# EAGLE design Shield (EAGLE 8.7.0)
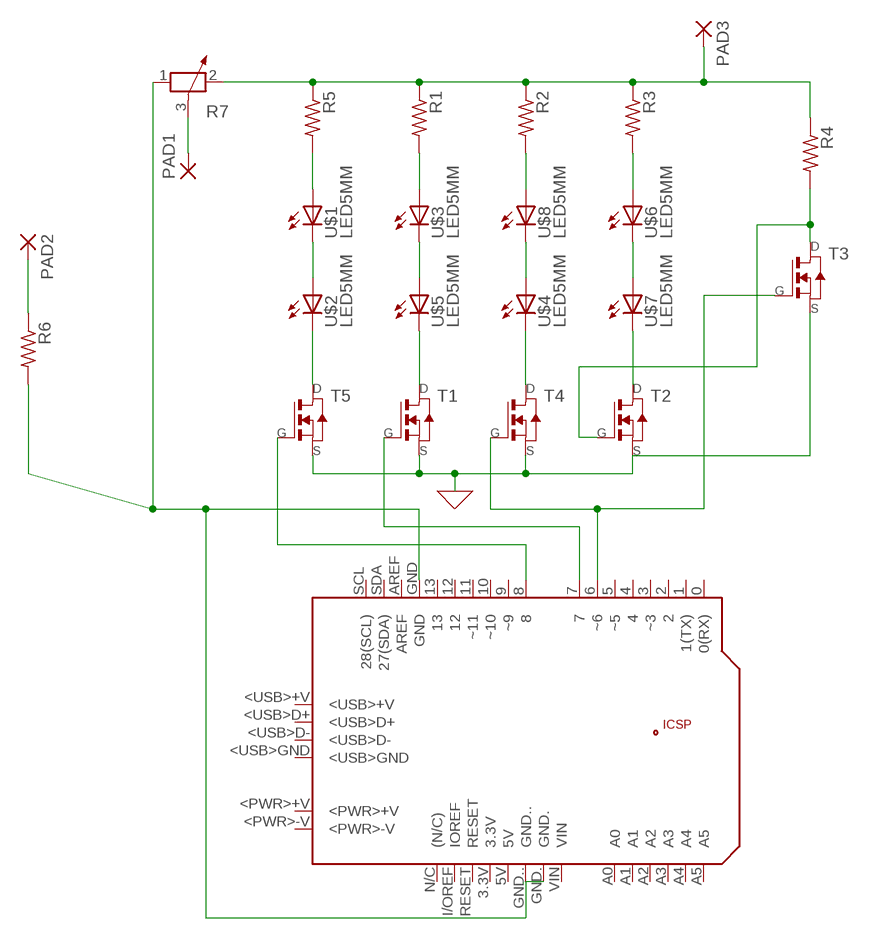
[diagram p0: schematic, sheet 1]

## Parts
PAD1  2,15/1,0  [2,15/1,0]
PAD2  2,15/1,0  [2,15/1,0]
PAD3  2,15/1,0  [2,15/1,0]
PCB1  ARDUINO_UNO  [ARDUINO_UNO]
R1  RES-US1206FAB  [R1206FAB]
R2  RES-US1206FAB  [R1206FAB]
R3  RES-US1206FAB  [R1206FAB]
R4  RES-US1206FAB  [R1206FAB]
R5  RES-US1206FAB  [R1206FAB]
R6  RES-US1206FAB  [R1206FAB]
R7  POTENTIOMETER_PT-10  [PT-10]
T1  NMOSFETSOT23  [SOT-23]
T2  NMOSFETSOT23  [SOT-23]
T3  NMOSFETSOT23  [SOT-23]
T4  NMOSFETSOT23  [SOT-23]
T5  NMOSFETSOT23  [SOT-23]
U$1  LED5MM  [5MM]
U$2  LED5MM  [5MM]
U$3  LED5MM  [5MM]
U$4  LED5MM  [5MM]
U$5  LED5MM  [5MM]
U$6  LED5MM  [5MM]
U$7  LED5MM  [5MM]
U$8  LED5MM  [5MM]

## Nets
GND: PCB1.GND PCB1.GND. PCB1.GND.. R6.2 R7.1 T1.2(S) T2.2(S) T3.2(S) T4.2(S) T5.2(S)
N$1: U$1.OUT(C) U$2.IN(A)
N$2: U$3.OUT(C) U$5.IN(A)
N$3: U$4.IN(A) U$8.OUT(C)
N$4: U$6.OUT(C) U$7.IN(A)
N$5: R5.2 U$1.IN(A)
N$6: R1.2 U$3.IN(A)
N$7: R2.2 U$8.IN(A)
N$8: R3.2 U$6.IN(A)
N$9: PAD1.1(P) R7.3
N$10: T5.1(D) U$2.OUT(C)
N$11: T1.1(D) U$5.OUT(C)
N$12: T4.1(D) U$4.OUT(C)
N$13: PAD2.1(P) R6.1
N$14: T2.1(D) U$7.OUT(C)
N$17: PCB1.8 T5.3(G)
N$18: PCB1.7 T1.3(G)
N$19: PCB1.6(~6) T3.3(G) T4.3(G)
N$20: PAD3.1(P) R1.1 R2.1 R3.1 R4.1 R5.1 R7.2
N$21: R4.2 T2.3(G) T3.1(D)
Unconnected: PCB1.0(0(RX)) PCB1.1(1(TX)) PCB1.2 PCB1.3(~3) PCB1.3.3V PCB1.4 PCB1.5(~5) PCB1.5V PCB1.9(~9) PCB1.10(~10) PCB1.11(~11) PCB1.12 PCB1.13 PCB1.+5V PCB1.<PWR>+V PCB1.<PWR>-V PCB1.<USB>+V PCB1.<USB>D+ PCB1.<USB>D- PCB1.<USB>GND PCB1.A0 PCB1.A1 PCB1.A2 PCB1.A3 PCB1.A4 PCB1.A5 PCB1.AREF PCB1.GND_ PCB1.I/OREF(IOREF) PCB1.MISO PCB1.MOSI PCB1.N/C((N/C)) PCB1.RESET PCB1.RESET. PCB1.SCK PCB1.SCL(28(SCL)) PCB1.SDA(27(SDA)) PCB1.VIN

## Library data of the parts
PAD1-PAD3 = wirepad:2,15/1,0: THROUGH-HOLE PAD
PCB1 = E14_Arduino_revC:ARDUINO_UNO: Device for representing an Arduino Uno board with a footprint in an EAGLE design. Created by Dave Young for Element14. More EAGLE documentation at: http://www.element14.com/community/community/knode/cadsoft_eagle
R1-R6 = fab:RES-US: Resistor (US Symbol) Variants with postfix FAB are widened to allow the routing of internal traces
R7 = rcl:POTENTIOMETER_: Potentiometer; SPICEMODEL: POT; SPICEPREFIX: X
T1-T5 = fab:NMOSFET: MOS FET
U$1-U$8 = fab:LED: LED

## Board
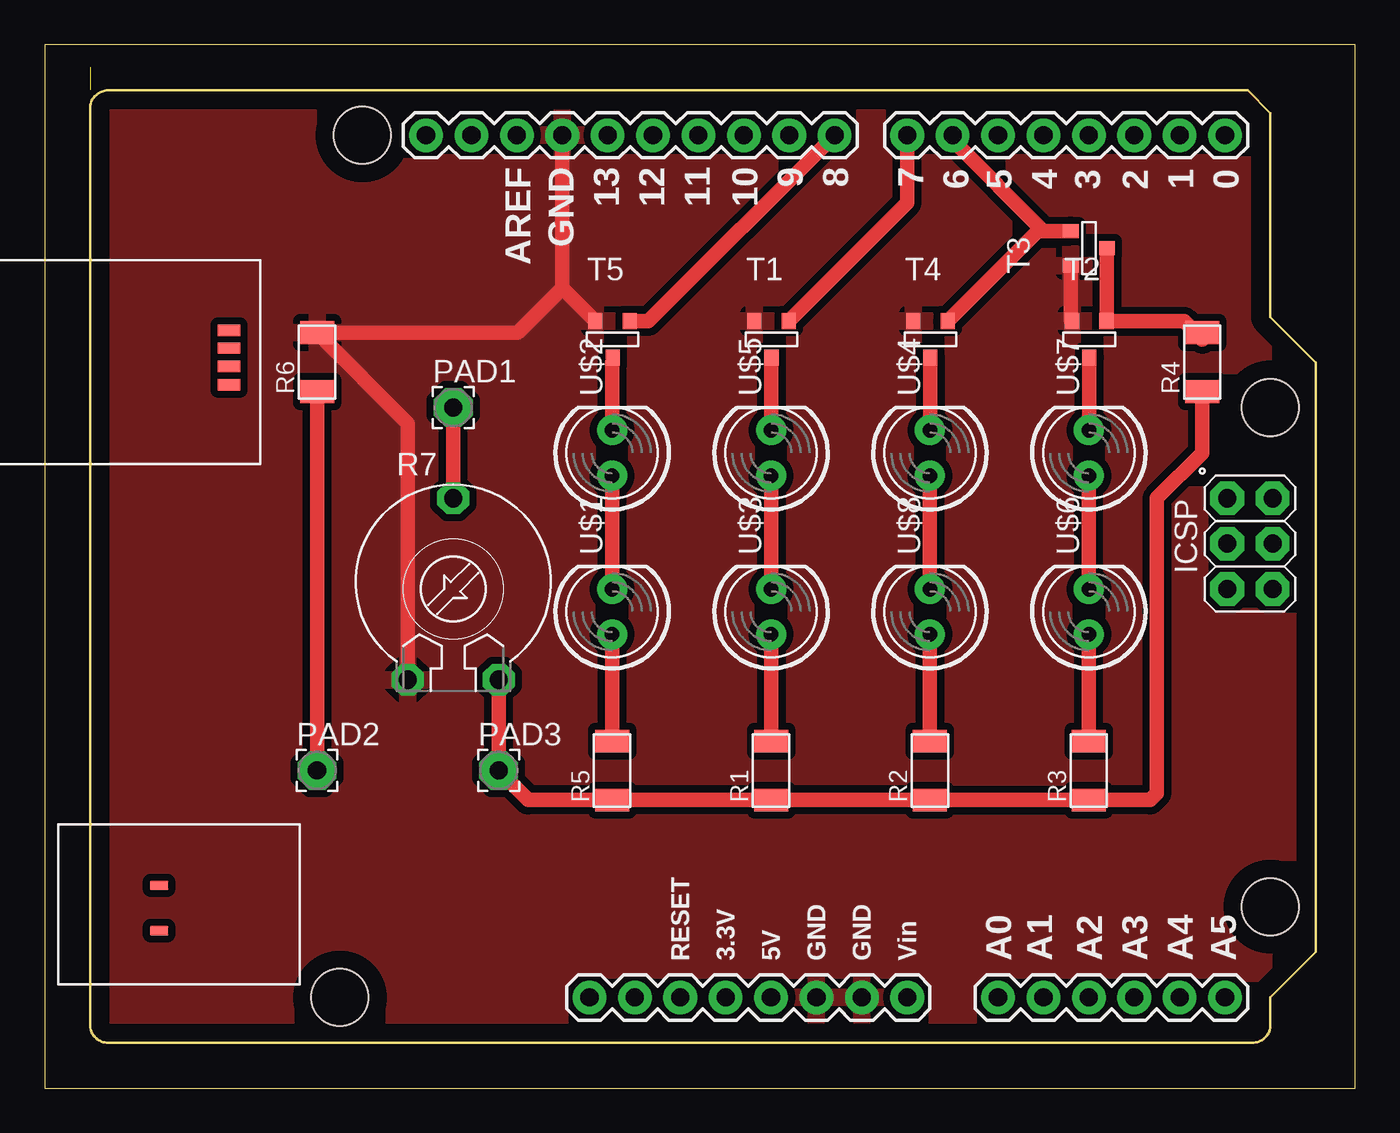
[diagram p1: board, top side]
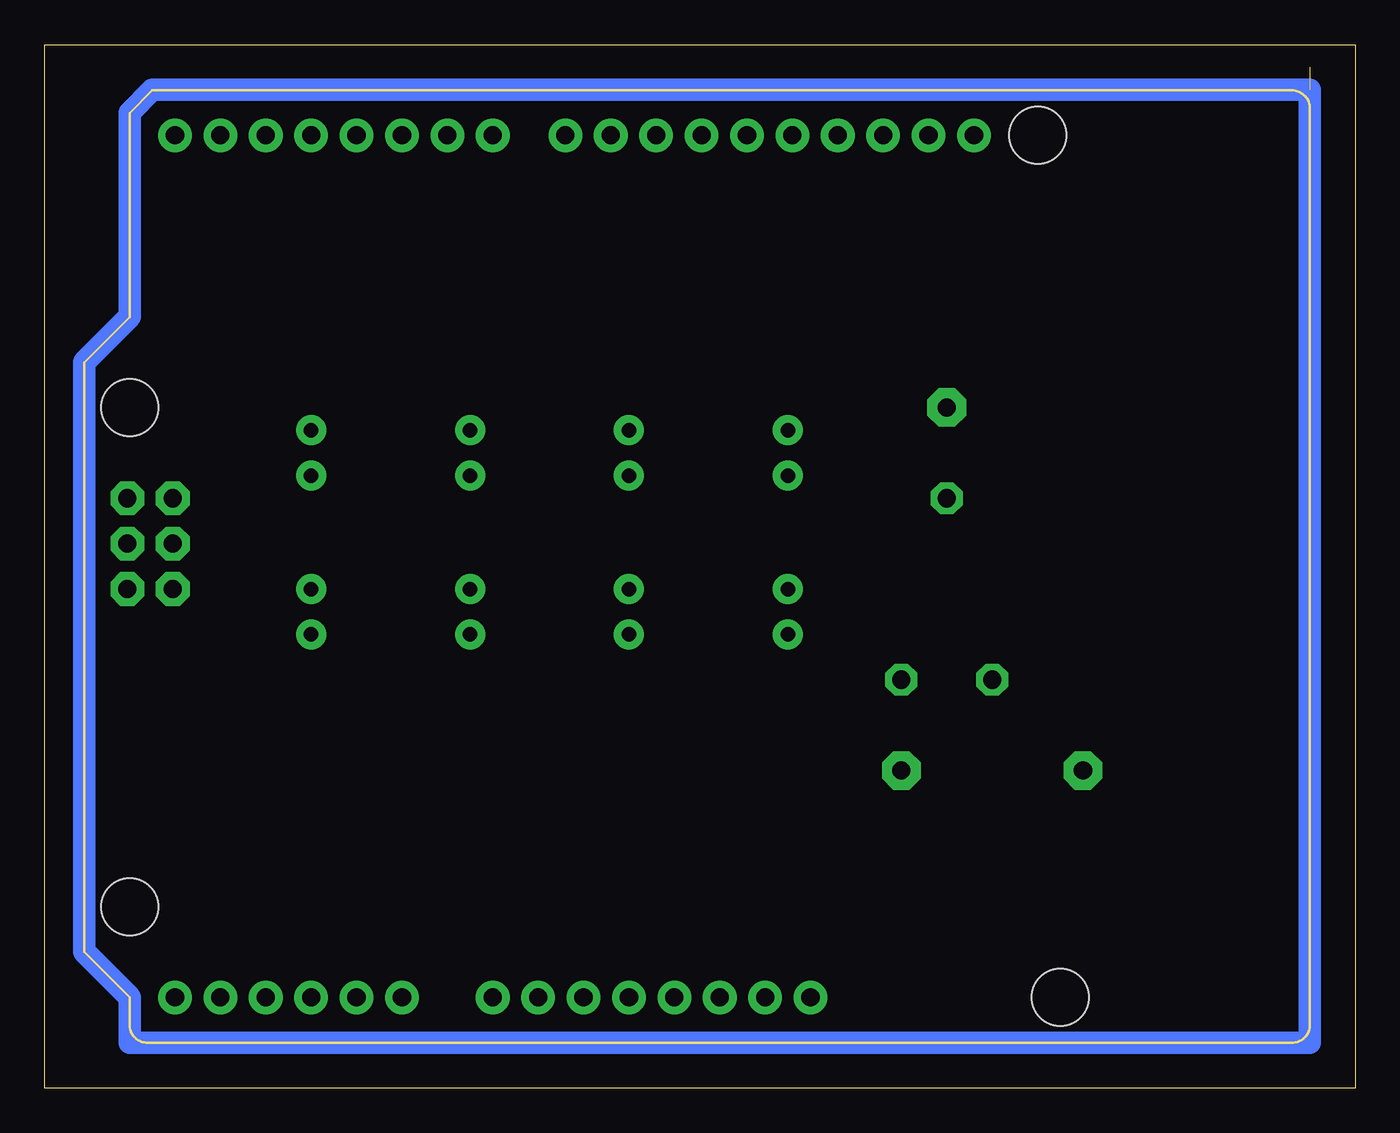
[diagram p2: board, bottom side, seen from below]

Size 73.33 x 58.41 mm. Coordinates in mm from the lower left corner, seen from the top.
Outline: 0,0 73.33,0 73.33,58.41 0,58.41 0,0
Copper layers (1*16): Top 0.035mm / dielectric 1.5mm / Bottom 0.035mm
Design rules "default *": minimum track width 16mil, minimum drill 0.35mm, track to track 16mil, track to pad 16mil, pad to pad 14mil, via to via 16mil, smd to smd 16mil, copper to edge 40mil, drill to drill 6mil, minimum pad ring 10mil, minimum via ring 8mil, stop-mask expansion 4mil, vias tented up to drill 0mil, thermal gap 16mil

### Footprints (pad centres in the part's own frame; a part is rotated, then mirrored left to right if it is on the bottom)
2,15/1,0 = drill 1.016 pad 2.159 octagon: 1 0,0
ARDUINO_UNO = drill 1.016 pad 1.88: 0 63.5,50.8; 1 60.96,50.8; 2 58.42,50.8; 3 55.88,50.8; 3.3V 35.56,2.54; 4 53.34,50.8; 5 50.8,50.8; 5V 38.1,2.54; 6 48.26,50.8; 7 45.72,50.8; 8 41.656,50.8; 9 39.116,50.8; 10 36.576,50.8; 11 34.036,50.8; 12 31.496,50.8; 13 28.956,50.8; A0 50.8,2.54; A1 53.34,2.54; A2 55.88,2.54; A3 58.42,2.54; A4 60.96,2.54; A5 63.5,2.54; AREF 23.876,50.8; GND 26.416,50.8; GND. 43.18,2.54; GND.. 40.64,2.54; I/OREF 30.48,2.54; N/C 27.94,2.54; RESET 33.02,2.54; SCL 18.796,50.8; SDA 21.336,50.8; VIN 45.72,2.54 | drill 1.016 pad 1.88 octagon: +5V 66.167,30.48; GND_ 66.167,25.4; MISO 63.627,30.48; MOSI 66.167,27.94; RESET. 63.627,25.4; SCK 63.627,27.94 | smd 1.016 x 0.508: <PWR>+V 3.861,8.814; <PWR>-V 3.861,6.274 | smd 1.27 x 0.635: <USB>+V 7.772,39.878; <USB>D+ 7.772,38.887; <USB>D- 7.772,37.871; <USB>GND 7.772,36.83 | hole 3.2: 66.04,7.62; 66.04,35.56; 15.24,50.8; 13.97,2.54
R1206FAB = smd 1.27 x 1.905: 1 -1.651,0; 2 1.651,0
PT-10 = drill 1.016 pad 1.778 octagon: 1 -2.54,-5.08; 2 2.54,-5.08; 3 0,5.08
SOT-23 = smd 0.787 x 0.889: 1 0.025,-1.016; 2 -0.94,1.016; 3 0.991,1.016
5MM = drill 0.813 pad 1.676: IN -1.27,0; OUT 1.27,0

### Placement (x,y rotation side)
PAD1  22.86,38.1 0 top
PAD2  15.24,17.78 0 top
PAD3  25.4,17.78 0 top
PCB1  2.54,2.54 0 top
R1  40.64,17.78 90 top
R2  49.53,17.78 90 top
R3  58.42,17.78 90 top
R4  64.77,40.64 90 top
R5  31.75,17.78 90 top
R6  15.24,40.64 90 top
R7  22.86,27.94 0 top
T1  40.64,41.91 0 top
T2  58.42,41.91 0 top
T3  58.42,46.99 90 top
T4  49.53,41.91 0 top
T5  31.75,41.91 0 top
U$1  31.75,26.67 90 top
U$2  31.75,35.56 90 top
U$3  40.64,26.67 90 top
U$4  49.53,35.56 90 top
U$5  40.64,35.56 90 top
U$6  58.42,26.67 90 top
U$7  58.42,35.56 90 top
U$8  49.53,26.67 90 top

### Tracks (layer width: path | path; a pad name or v marks a point on that pad's centre or on a via)
GND
  Top 0.813: T3.2 57.4,43 T2.2 | R7.1 20.32,37.21 R6.2 26.47,42.29 28.96,44.78 | T5.2 28.96,44.78 | 28.96,44.78 PCB1.GND
  pour Top: 3.81,55.88 2.54,54.61 2.54,3.81 3.81,2.54 67.31,2.54 68.58,3.81 68.58,5.08 71.12,7.62 71.12,40.64 68.58,43.18 68.58,54.61 67.31,55.88
N$1
  Top 0.813: U$1.OUT U$2.IN
N$2
  Top 0.813: U$5.IN U$3.OUT
N$3
  Top 0.813: U$4.IN U$8.OUT
N$4
  Top 0.813: U$6.OUT U$7.IN
N$5
  Top 0.813: R5.2 U$1.IN
N$6
  Top 0.813: U$3.IN R1.2
N$7
  Top 0.813: U$8.IN R2.2
N$8
  Top 0.813: R3.2 U$6.IN
N$9
  Top 0.813: R7.3 PAD1.1
N$10
  Top 0.813: U$2.OUT 31.75,40.64 31.77,40.66 T5.1
N$11
  Top 0.813: T1.1 40.66,36.85 U$5.OUT
N$12
  Top 0.813: T4.1 49.55,36.85 U$4.OUT
N$13
  Top 0.813: PAD2.1 R6.1
N$14
  Top 0.813: U$7.OUT 58.45,36.85 T2.1
N$15  (1 unrouted)
  Bottom 1.27: 2.54,55.88 2.54,2.54 68.58,2.54 68.58,5.08 71.12,7.62 71.12,40.64 68.58,43.18 68.58,54.61 67.31,55.88 2.54,55.88
N$17
  Top 0.813: T5.3 33.78,42.93 PCB1.8
N$18
  Top 0.813: T1.3 48.26,49.55 PCB1.7
N$19
  Top 0.813: T4.3 55.58,47.98 55.88,47.98 | 55.88,47.98 T3.3 | 55.88,47.98 50.8,53.06 PCB1.6
N$20
  Top 0.813: R4.1 64.77,35.56 62.23,33.02 62.23,16.51 61.85,16.13 R3.1 R2.1 R1.1 R5.1 27.05,16.13 PAD3.1 R7.2
N$21
  Top 0.813: T3.1 59.44,42.95 T2.3 63.75,42.93 64.77,41.91 R4.2